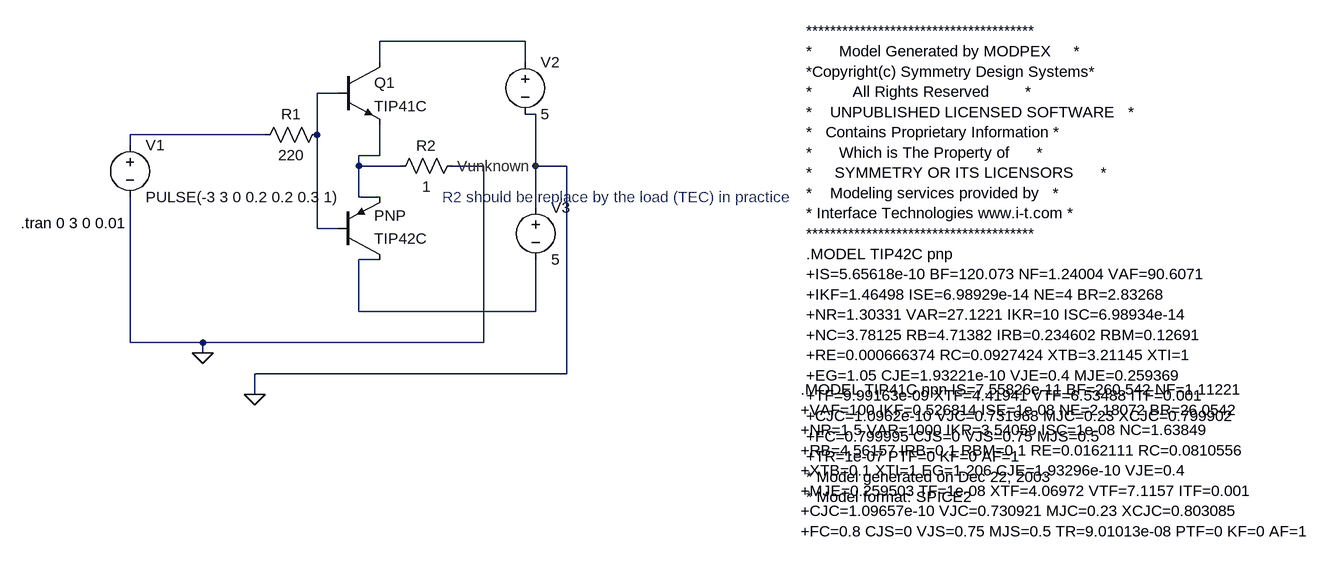
[diagram p0: schematic push-pull_pnp.asc]
push-pull_pnp.asc, the LTspice schematic file:
Version 4
SHEET 1 4988 1328
WIRE 560 64 336 64
WIRE 336 96 336 64
WIRE 560 96 560 64
WIRE 272 144 240 144
WIRE 576 176 560 176
WIRE 160 208 -48 208
WIRE 240 208 240 144
WIRE -48 224 -48 208
WIRE 336 240 336 192
WIRE 336 240 304 240
WIRE 304 256 304 240
WIRE 368 256 304 256
WIRE 496 256 448 256
WIRE 576 256 576 176
WIRE 624 256 576 256
WIRE 304 304 304 256
WIRE 336 304 304 304
WIRE 576 320 576 256
WIRE 240 352 240 208
WIRE 272 352 240 352
WIRE 336 400 304 400
WIRE 304 480 304 400
WIRE 576 480 576 400
WIRE 576 480 304 480
WIRE -48 528 -48 304
WIRE 64 528 -48 528
WIRE 496 528 496 256
WIRE 496 528 64 528
WIRE 64 544 64 528
WIRE 624 576 624 256
WIRE 624 576 144 576
WIRE 144 608 144 576
FLAG 144 608 0
FLAG 576 256 Vunknown
FLAG 64 544 0
SYMBOL voltage -48 208 R0
SYMATTR InstName V1
SYMATTR Value PULSE(-3 3 0 0.2 0.2 0.3 1)
SYMBOL voltage 560 80 R0
SYMATTR InstName V2
SYMATTR Value 5
SYMBOL voltage 576 304 R0
SYMATTR InstName V3
SYMATTR Value 5
SYMBOL res 256 192 R90
WINDOW 0 0 56 VBottom 2
WINDOW 3 32 56 VTop 2
SYMATTR InstName R1
SYMATTR Value 220
SYMBOL res 464 240 R90
WINDOW 0 0 56 VBottom 2
WINDOW 3 32 56 VTop 2
SYMATTR InstName R2
SYMATTR Value 1
SYMBOL npn 272 96 R0
SYMATTR InstName Q1
SYMATTR Value TIP41C
SYMBOL pnp 272 400 M180
SYMATTR InstName TIP42C
TEXT -216 344 Left 2 !.tran 0 3 0 0.01
TEXT 984 600 Left 2 !.MODEL TIP41C npn IS=7.55826e-11 BF=260.542 NF=1.11221\n+VAF=100 IKF=0.526814 ISE=1e-08 NE=2.18072 BR=26.0542\n+NR=1.5 VAR=1000 IKR=3.54059 ISC=1e-08 NC=1.63849\n+RB=4.56157 IRB=0.1 RBM=0.1 RE=0.0162111 RC=0.0810556\n+XTB=0.1 XTI=1 EG=1.206 CJE=1.93296e-10 VJE=0.4\n+MJE=0.259503 TF=1e-08 XTF=4.06972 VTF=7.1157 ITF=0.001\n+CJC=1.09657e-10 VJC=0.730921 MJC=0.23 XCJC=0.803085\n+FC=0.8 CJS=0 VJS=0.75 MJS=0.5 TR=9.01013e-08 PTF=0 KF=0 AF=1
TEXT 992 48 Left 2 !**************************************\n*      Model Generated by MODPEX     *\n*Copyright(c) Symmetry Design Systems*\n*         All Rights Reserved        *\n*    UNPUBLISHED LICENSED SOFTWARE   *\n*   Contains Proprietary Information *\n*      Which is The Property of      *\n*     SYMMETRY OR ITS LICENSORS      *\n*    Modeling services provided by   *\n* Interface Technologies www.i-t.com *\n**************************************\n.MODEL TIP42C pnp\n+IS=5.65618e-10 BF=120.073 NF=1.24004 VAF=90.6071\n+IKF=1.46498 ISE=6.98929e-14 NE=4 BR=2.83268\n+NR=1.30331 VAR=27.1221 IKR=10 ISC=6.98934e-14\n+NC=3.78125 RB=4.71382 IRB=0.234602 RBM=0.12691\n+RE=0.000666374 RC=0.0927424 XTB=3.21145 XTI=1\n+EG=1.05 CJE=1.93221e-10 VJE=0.4 MJE=0.259369\n+TF=9.99163e-09 XTF=4.41941 VTF=6.53488 ITF=0.001\n+CJC=1.0962e-10 VJC=0.731968 MJC=0.23 XCJC=0.799902\n+FC=0.799995 CJS=0 VJS=0.75 MJS=0.5\n+TR=1e-07 PTF=0 KF=0 AF=1\n* Model generated on Dec 22, 2003\n* Model format: SPICE2
TEXT 432 304 Left 2 ;R2 should be replace by the load (TEC) in practice

The netlist it stands for:
* push-pull_pnp.asc
V1 N003 0 PULSE(-3 3 0 0.2 0.2 0.3 1)
V2 N001 0 5
V3 0 N005 5
R1 N002 N003 220
R2 0 N004 1
Q1 N001 N002 N004 0 TIP41C
Q§TIP42C N005 N002 N004 0 PNP
.model NPN NPN
.model PNP PNP
.lib standard.bjt
.tran 0 3 0 0.01
.MODEL TIP41C npn IS=7.55826e-11 BF=260.542 NF=1.11221
+VAF=100 IKF=0.526814 ISE=1e-08 NE=2.18072 BR=26.0542
+NR=1.5 VAR=1000 IKR=3.54059 ISC=1e-08 NC=1.63849
+RB=4.56157 IRB=0.1 RBM=0.1 RE=0.0162111 RC=0.0810556
+XTB=0.1 XTI=1 EG=1.206 CJE=1.93296e-10 VJE=0.4
+MJE=0.259503 TF=1e-08 XTF=4.06972 VTF=7.1157 ITF=0.001
+CJC=1.09657e-10 VJC=0.730921 MJC=0.23 XCJC=0.803085
+FC=0.8 CJS=0 VJS=0.75 MJS=0.5 TR=9.01013e-08 PTF=0 KF=0 AF=1
**************************************
*      Model Generated by MODPEX     *
*Copyright(c) Symmetry Design Systems*
*         All Rights Reserved        *
*    UNPUBLISHED LICENSED SOFTWARE   *
*   Contains Proprietary Information *
*      Which is The Property of      *
*     SYMMETRY OR ITS LICENSORS      *
*    Modeling services provided by   *
* Interface Technologies www.i-t.com *
**************************************
.MODEL TIP42C pnp
+IS=5.65618e-10 BF=120.073 NF=1.24004 VAF=90.6071
+IKF=1.46498 ISE=6.98929e-14 NE=4 BR=2.83268
+NR=1.30331 VAR=27.1221 IKR=10 ISC=6.98934e-14
+NC=3.78125 RB=4.71382 IRB=0.234602 RBM=0.12691
+RE=0.000666374 RC=0.0927424 XTB=3.21145 XTI=1
+EG=1.05 CJE=1.93221e-10 VJE=0.4 MJE=0.259369
+TF=9.99163e-09 XTF=4.41941 VTF=6.53488 ITF=0.001
+CJC=1.0962e-10 VJC=0.731968 MJC=0.23 XCJC=0.799902
+FC=0.799995 CJS=0 VJS=0.75 MJS=0.5
+TR=1e-07 PTF=0 KF=0 AF=1
* Model generated on Dec 22, 2003
* Model format: SPICE2
* R2 should be replace by the load (TEC) in practice
.backanno
.end